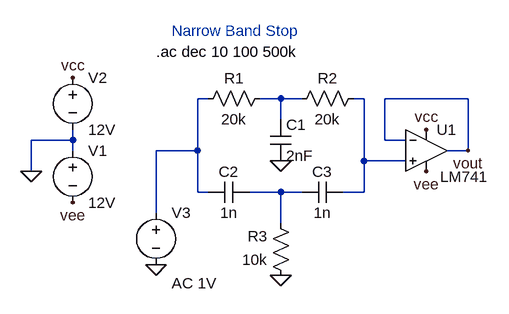
[diagram p0: schematic narrow_band_stop.asc]
narrow_band_stop.asc, the LTspice schematic file:
Version 4.1
SHEET 1 880 680
WIRE 192 80 176 80
WIRE 304 80 272 80
WIRE 336 80 304 80
WIRE 432 80 416 80
WIRE 592 80 464 80
WIRE 304 112 304 80
WIRE -16 144 -16 128
WIRE -16 144 -80 144
WIRE 464 144 464 80
WIRE 496 144 464 144
WIRE -16 160 -16 144
WIRE 176 160 176 80
WIRE 176 160 112 160
WIRE 592 160 592 80
WIRE 592 160 560 160
WIRE 432 176 432 80
WIRE 496 176 432 176
WIRE -80 192 -80 144
WIRE 176 224 176 160
WIRE 192 224 176 224
WIRE 304 224 256 224
WIRE 336 224 304 224
WIRE 432 224 432 176
WIRE 432 224 400 224
WIRE 112 256 112 160
WIRE 304 272 304 224
FLAG -80 192 0
FLAG 528 128 vcc
FLAG -16 48 vcc
FLAG 528 192 vee
FLAG -16 240 vee
FLAG 304 176 0
FLAG 304 352 0
FLAG 112 336 0
FLAG 592 160 vout
SYMBOL voltage -16 144 R0
WINDOW 123 0 0 Left 0
WINDOW 39 0 0 Left 0
SYMATTR InstName V1
SYMATTR Value 12V
SYMBOL voltage -16 32 R0
WINDOW 123 0 0 Left 0
WINDOW 39 0 0 Left 0
SYMATTR InstName V2
SYMATTR Value 12V
SYMBOL LM741 528 96 R0
WINDOW 3 21 104 Left 2
SYMATTR InstName U1
SYMBOL res 288 64 R90
WINDOW 0 0 56 VBottom 2
WINDOW 3 32 56 VTop 2
SYMATTR InstName R1
SYMATTR Value 20k
SYMBOL res 432 64 R90
WINDOW 0 0 56 VBottom 2
WINDOW 3 32 56 VTop 2
SYMATTR InstName R2
SYMATTR Value 20k
SYMBOL res 320 368 R180
WINDOW 0 36 76 Left 2
WINDOW 3 36 40 Left 2
SYMATTR InstName R3
SYMATTR Value 10k
SYMBOL cap 288 112 R0
SYMATTR InstName C1
SYMATTR Value 2nF
SYMBOL cap 256 208 R90
WINDOW 0 0 32 VBottom 2
WINDOW 3 32 32 VTop 2
SYMATTR InstName C2
SYMATTR Value 1n
SYMBOL cap 400 208 R90
WINDOW 0 0 32 VBottom 2
WINDOW 3 32 32 VTop 2
SYMATTR InstName C3
SYMATTR Value 1n
SYMBOL voltage 112 240 R0
WINDOW 123 24 124 Left 2
WINDOW 39 0 0 Left 0
SYMATTR InstName V3
SYMATTR Value ""
SYMATTR Value2 AC 1V
TEXT 136 -24 Left 2 ;Narrow Band Stop
TEXT 112 8 Left 2 !.ac dec 10 100 500k

The netlist it stands for:
* narrow_band_stop.asc
V1 0 vee 12V
V2 vcc 0 12V
X§U1 N003 vout vcc vee vout LM741  ; pins In+ In- V+ V- OUT
R1 N002 N001 20k
R2 N003 N002 20k
R3 0 N004 10k
C1 N002 0 2nF
C2 N004 N001 1n
C3 N003 N004 1n
V3 N001 0 AC 1V
* Narrow Band Stop
.ac dec 10 100 500k
.lib LM741.lib
.backanno
.end